# EAGLE schematic Camara_V4 (EAGLE 7.6.0)
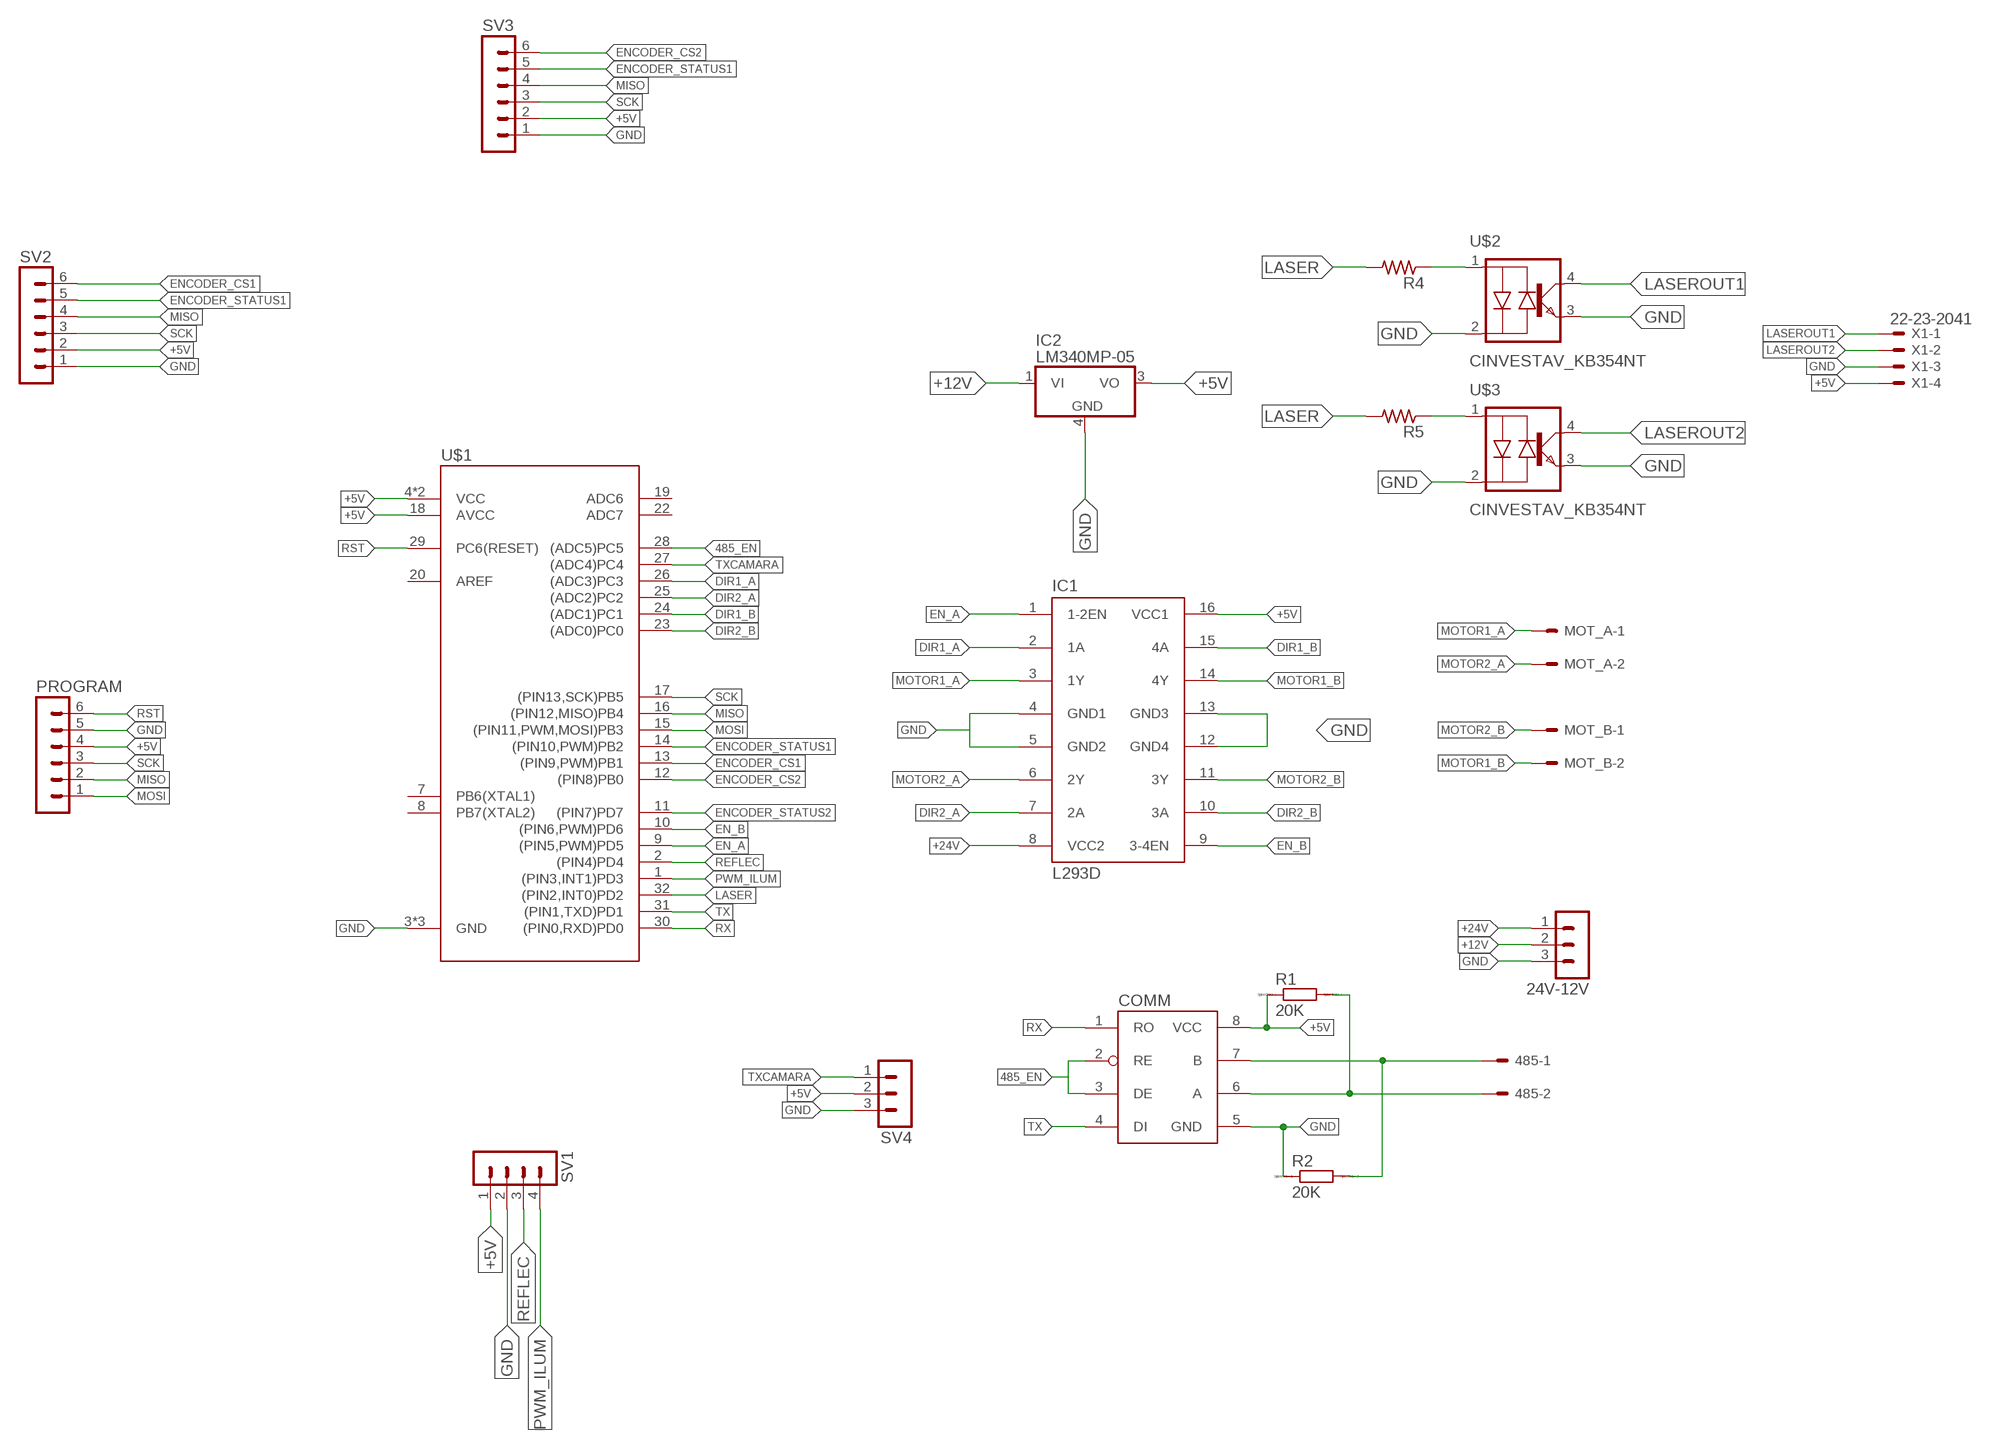
[diagram p0: schematic, sheet 1]

## Parts
24V-12V  MA03-1  [MA03-1]
485  CINVESTAV_1X02  [CINVESTAV_1X02]
COMM  CINVESTAV_ADM1485  [CINVESTAV_SOIC8]
IC1  L293D  [DIL16]
IC2  LM340MP-05  [SOT223]
MOT_A  CINVESTAV_1X02  [CINVESTAV_1X02]
MOT_B  CINVESTAV_1X02  [CINVESTAV_1X02]
PROGRAM  MA06-1  [MA06-1]
R1  20K  RR1206  [R1206]
R2  20K  RR1206  [R1206]
R4  R-US_M1206  [M1206]
R5  R-US_M1206  [M1206]
SV1  MA04-1  [MA04-1]
SV2  MA06-1  [MA06-1]
SV3  MA06-1  [MA06-1]
SV4  MA03-1  [MA03-1]
U$1  CINVESTAV_ATMEGA328  [CINVESTAV_TQFP32-08]
U$2  CINVESTAV_KB354NT  [CINVESTAV_SOIC4]
U$3  CINVESTAV_KB354NT  [CINVESTAV_SOIC4]
X1  22-23-2041  [22-23-2041]

## Nets
485_EN: COMM.2(RE) COMM.3(DE) U$1.28((ADC5)PC5)
+5V: COMM.8(VCC) IC1.16(VCC1) IC2.3(VO) PROGRAM.4 R1.1 SV1.1 SV2.2 SV3.2 SV4.2 U$1.4(VCC) U$1.6(VCC) U$1.18(AVCC) X1.4
+12V: 24V-12V.2 IC2.1(VI)
+24V: 24V-12V.1 IC1.8(VCC2)
DIR1_A: IC1.2(1A) U$1.26((ADC3)PC3)
DIR1_B: IC1.15(4A) U$1.24((ADC1)PC1)
DIR2_A: IC1.7(2A) U$1.25((ADC2)PC2)
DIR2_B: IC1.10(3A) U$1.23((ADC0)PC0)
EN_A: IC1.1(1-2EN) U$1.9((PIN5,PWM)PD5)
EN_B: IC1.9(3-4EN) U$1.10((PIN6,PWM)PD6)
ENCODER_CS1: SV2.6 U$1.13((PIN9,PWM)PB1)
ENCODER_CS2: SV3.6 U$1.12((PIN8)PB0)
ENCODER_STATUS1: SV2.5 SV3.5 U$1.14((PIN10,PWM)PB2)
ENCODER_STATUS2: U$1.11((PIN7)PD7)
GND: 24V-12V.3 COMM.5(GND) IC1.4(GND1) IC1.5(GND2) IC1.12(GND4) IC1.13(GND3) IC2.4(GND) PROGRAM.5 R2.1 SV1.2 SV2.1 SV3.1 SV4.3 U$1.3(GND) U$1.5(GND) U$1.21(GND) U$2.2(C/A) U$2.3(EMIT) U$3.2(C/A) U$3.3(EMIT) X1.3
LASER: R4.2 R5.2 U$1.32((PIN2,INT0)PD2)
LASEROUT1: U$2.4(COL) X1.1
LASEROUT2: U$3.4(COL) X1.2
MISO: PROGRAM.2 SV2.4 SV3.4 U$1.16((PIN12,MISO)PB4)
MOSI: PROGRAM.1 U$1.15((PIN11,PWM,MOSI)PB3)
MOTOR1_A: IC1.3(1Y) MOT_A.1
MOTOR1_B: IC1.14(4Y) MOT_B.2
MOTOR2_A: IC1.6(2Y) MOT_A.2
MOTOR2_B: IC1.11(3Y) MOT_B.1
N$2: R4.1 U$2.1(A/C)
N$3: 485.2 COMM.6(A) R1.2
N$4: 485.1 COMM.7(B) R2.2
N$8: R5.1 U$3.1(A/C)
PWM_ILUM: SV1.4 U$1.1((PIN3,INT1)PD3)
REFLEC: SV1.3 U$1.2((PIN4)PD4)
RST: PROGRAM.6 U$1.29(PC6(RESET))
RX: COMM.1(RO) U$1.30((PIN0,RXD)PD0)
SCK: PROGRAM.3 SV2.3 SV3.3 U$1.17((PIN13,SCK)PB5)
TX: COMM.4(DI) U$1.31((PIN1,TXD)PD1)
TXCAMARA: SV4.1 U$1.27((ADC4)PC4)
Unconnected: U$1.7(PB6(XTAL1)) U$1.8(PB7(XTAL2)) U$1.19(ADC6) U$1.20(AREF) U$1.22(ADC7)

## Library data of the parts
24V-12V SV4 = con-lstb:MA03-1: PIN HEADER; OC_FARNELL: unknown; OC_NEWARK: unknown
485 MOT_A MOT_B = VUG:CINVESTAV_1X02: PIN HEADER 1X02
COMM = VUG:CINVESTAV_ADM1485: ADM1485: Low power RS-1485 Transceiver
IC1 = st-microelectronics:L293D: PUSH-PULL 4 CHANNEL DRIVER; MPN: L293D; OC_FARNELL: 9589619; OC_NEWARK: 56P8249
IC2 = linear:LM340?-*: Positive VOLTAGE REGULATOR Source: http://cache.national.com/ds/LM/LM340.pdf
PROGRAM SV2 SV3 = con-lstb:MA06-1: PIN HEADER; OC_FARNELL: unknown; OC_NEWARK: unknown
R1 R2 = eagle-ltspice:R: RESISTOR, European symbol; SPICEMODEL: NONE; SPICEPREFIX: R
R4 R5 = resistor:R-US_: RESISTOR, American symbol
SV1 = con-lstb:MA04-1: PIN HEADER; OC_FARNELL: unknown; OC_NEWARK: unknown
U$1 = VUG:CINVESTAV_ATMEGA328: Atmega328 13 Entradas Digitales 7 Entradas Análogicas 6 PWM
U$2 U$3 = VUG:CINVESTAV_KB354NT
X1 = con-molex:22-23-2041: .100" (2.54mm) Center Header - 4 Pin; MF: MOLEX; MPN: 22-23-2041; OC_FARNELL: 1462920; OC_NEWARK: 38C0355